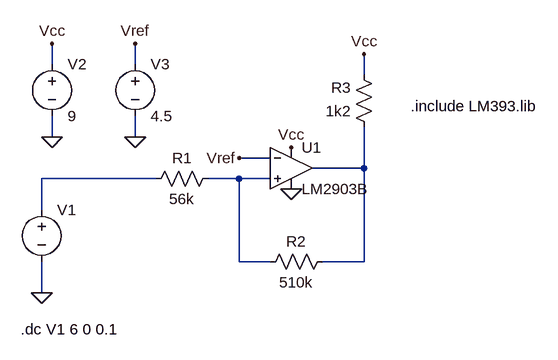
[diagram p0: schematic ST-No inversor.asc]
ST-No inversor.asc, the LTspice schematic file:
Version 4
SHEET 1 880 680
WIRE -256 16 -256 -16
WIRE -128 16 -128 -16
WIRE 224 32 224 0
WIRE -256 128 -256 96
WIRE -128 128 -128 96
WIRE 80 160 32 160
WIRE 224 176 224 112
WIRE 224 176 144 176
WIRE -96 192 -272 192
WIRE 32 192 -16 192
WIRE 80 192 32 192
WIRE -272 240 -272 192
WIRE 32 320 32 192
WIRE 80 320 32 320
WIRE 224 320 224 176
WIRE 224 320 160 320
WIRE -272 368 -272 320
FLAG -256 128 0
FLAG -256 -16 Vcc
FLAG 112 144 Vcc
FLAG 112 208 0
FLAG -272 368 0
FLAG 224 0 Vcc
FLAG -128 128 0
FLAG -128 -16 Vref
FLAG 32 160 Vref
SYMBOL Comparators\\LT1018 112 176 R0
SYMATTR InstName U1
SYMATTR Value LM2903B
SYMBOL res 0 176 R90
WINDOW 0 0 56 VBottom 2
WINDOW 3 32 56 VTop 2
SYMATTR InstName R1
SYMATTR Value 56k
SYMBOL res 176 304 R90
WINDOW 0 0 56 VBottom 2
WINDOW 3 32 56 VTop 2
SYMATTR InstName R2
SYMATTR Value 510k
SYMBOL res 240 128 R180
WINDOW 0 36 76 Left 2
WINDOW 3 36 40 Left 2
SYMATTR InstName R3
SYMATTR Value 1k2
SYMBOL voltage -272 224 R0
WINDOW 123 0 0 Left 0
WINDOW 39 0 0 Left 0
SYMATTR InstName V1
SYMATTR Value ""
SYMBOL voltage -256 0 R0
WINDOW 123 0 0 Left 0
WINDOW 39 0 0 Left 0
SYMATTR InstName V2
SYMATTR Value 9
SYMBOL voltage -128 0 R0
WINDOW 123 0 0 Left 0
WINDOW 39 0 0 Left 0
SYMATTR InstName V3
SYMATTR Value 4.5
TEXT 296 80 Left 2 !.include LM393.lib
TEXT -304 424 Left 2 !.dc V1 6 0 0.1

The netlist it stands for:
* ST-No inversor.asc
XU1 N003 Vref Vcc 0 N001 LT1018  ; LM2903B, pins In+ In- V+ V- OUT
R1 N003 N002 56k
R2 N001 N003 510k
R3 N001 Vcc 1k2
V1 N002 0
V2 Vcc 0 9
V3 Vref 0 4.5
.include LM393.lib
.dc V1 6 0 0.1
.lib LTC1.lib
.backanno
.end